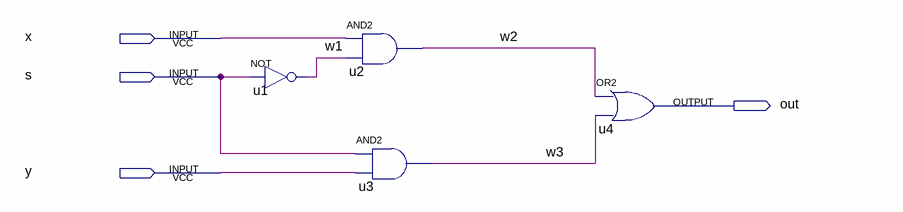
[diagram p0: schematic sheet]
// Quartus schematic lab2.bdf as structural Verilog: 4 symbols, 4 pins
module lab2 (
  input  x,
  input  s,
  input  y,
  output out
);

  wire w1, w2, w3;

  not u1 (w1, s);
  and u2 (w2, x, w1);
  and u3 (w3, s, y);
  or u4 (out, w2, w3);
endmodule
